# Altium project backscatter_radio.PrjPCB
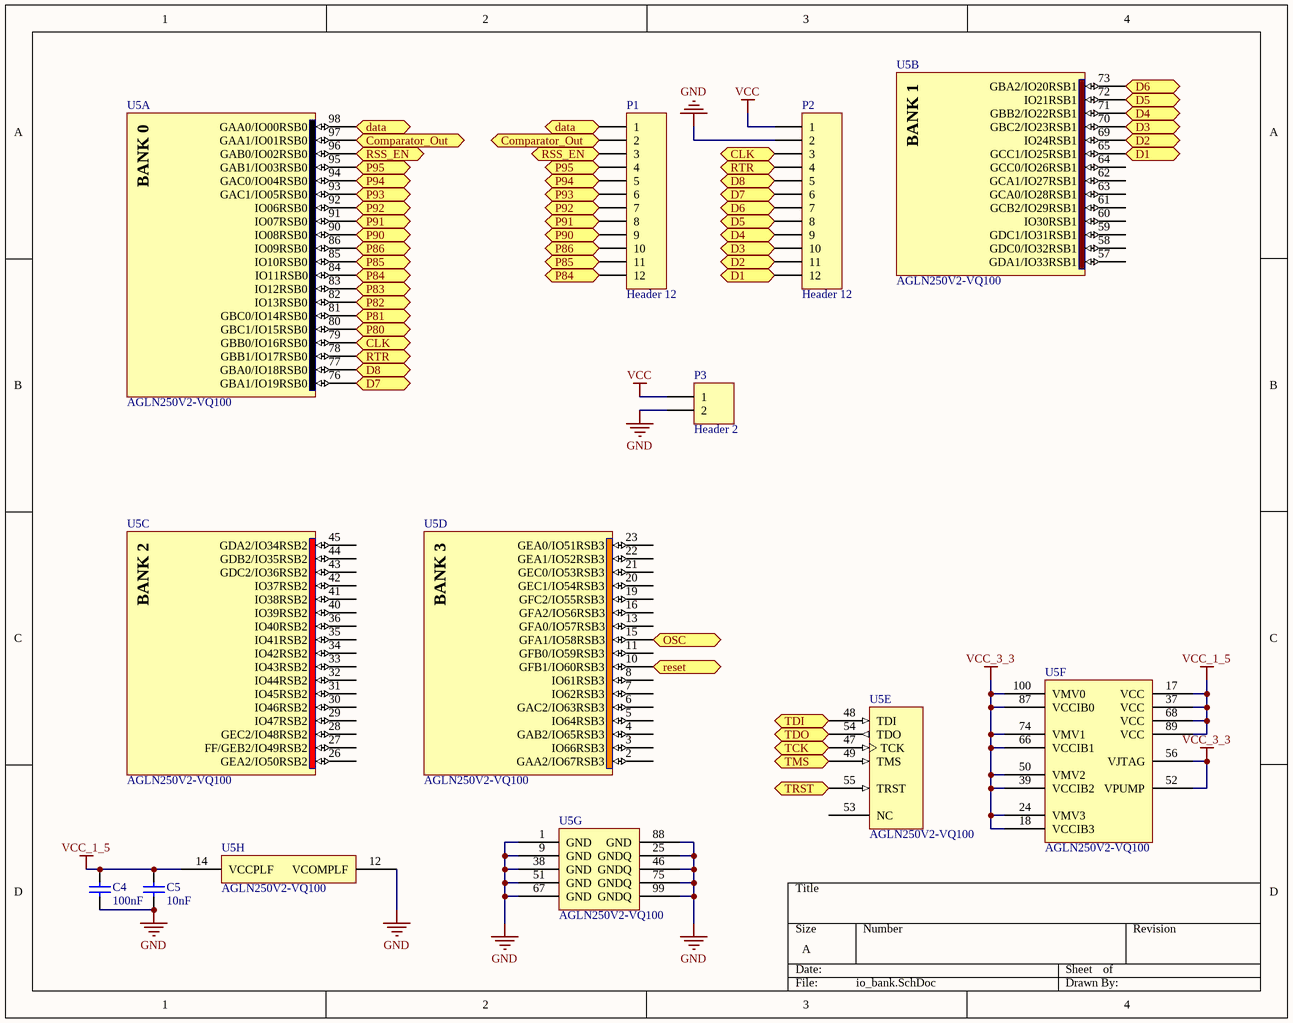
[diagram p0: io_bank.SchDoc]
3 sheets, 60 parts. Net scope: flat (ports and power ports of the same name join across sheets).
Board file: fpga_radio.PcbDoc
Sheets:
  io_bank.SchDoc
  power.SchDoc
  mimo.SchDoc

## Sheet io_bank.SchDoc
size A

### Parts
C4  value 100nF  [0603]  (hidden comment: Cap)
C5  value 10nF  [0603]  (hidden comment: Cap)
P1  Header 12  [HDR1X12]
P2  Header 12  [HDR1X12]
P3  Header 2  [HDR1X2]
U5  AGLN250V2-VQ100  [VQ100_N]  (parts A,B,C,D,E,F,G,H of 8)

### Ports
CLK, Comparator_Out, D1, D2, D3, D4, D5, D6, D7, D8, data, OSC, P80, P81, P82, P83, P84, P85, P86, P90, P91, P92, P93, P94, P95, reset, RSS_EN, RTR, TCK, TDI, TDO, TMS, TRST

### Nets
GND: C4.1 C5.1 P2.2 P3.2 U5.1(GND) U5.9(GND) U5.12(VCOMPLF) U5.25(GNDQ) U5.38(GND) U5.46(GNDQ) U5.51(GND) U5.67(GND) U5.75(GNDQ) U5.88(GND) U5.99(GNDQ)
VCC: P2.1 P3.1
VCC_1_5: C4.2 C5.2 U5.14(VCCPLF) U5.17(VCC) U5.37(VCC) U5.68(VCC) U5.89(VCC)
VCC_3_3: U5.18(VCCIB3) U5.24(VMV3) U5.39(VCCIB2) U5.50(VMV2) U5.52(VPUMP) U5.56(VJTAG) U5.66(VCCIB1) U5.74(VMV1) U5.87(VCCIB0) U5.100(VMV0)
NetC32_2: U5.10(GFB1/IO60RSB3) ; port reset
NetP1_1: P1.1 U5.98(GAA0/IO00RSB0) ; port data
NetP1_2: P1.2 U5.97(GAA1/IO01RSB0) ; port Comparator_Out
NetP1_3: P1.3 U5.96(GAB0/IO02RSB0) ; port RSS_EN
NetP1_4: P1.4 U5.95(GAB1/IO03RSB0) ; port P95
NetP1_5: P1.5 U5.94(GAC0/IO04RSB0) ; port P94
NetP1_6: P1.6 U5.93(GAC1/IO05RSB0) ; port P93
NetP1_7: P1.7 U5.92(IO06RSB0) ; port P92
NetP1_8: P1.8 U5.91(IO07RSB0) ; port P91
NetP1_9: P1.9 U5.90(IO08RSB0) ; port P90
NetP1_10: P1.10 U5.86(IO09RSB0) ; port P86
NetP1_11: P1.11 U5.85(IO10RSB0) ; port P85
NetP1_12: P1.12 U5.84(IO11RSB0) ; port P84
NetP2_3: P2.3 U5.79(GBB0/IO16RSB0) ; port CLK
NetP2_4: P2.4 U5.78(GBB1/IO17RSB0) ; port RTR
NetP2_5: P2.5 U5.77(GBA0/IO18RSB0) ; port D8
NetP2_6: P2.6 U5.76(GBA1/IO19RSB0) ; port D7
NetP2_7: P2.7 U5.73(GBA2/IO20RSB1) ; port D6
NetP2_8: P2.8 U5.72(IO21RSB1) ; port D5
NetP2_9: P2.9 U5.71(GBB2/IO22RSB1) ; port D4
NetP2_10: P2.10 U5.70(GBC2/IO23RSB1) ; port D3
NetP2_11: P2.11 U5.69(IO24RSB1) ; port D2
NetP2_12: P2.12 U5.65(GCC1/IO25RSB1) ; port D1
NetP4_1: U5.47(TCK) ; port TCK
NetP4_3: U5.54(TDO) ; port TDO
NetP4_5: U5.49(TMS) ; port TMS
NetP4_8: U5.55(TRST) ; port TRST
NetP4_9: U5.48(TDI) ; port TDI
NetU5_15: U5.15(GFA1/IO58RSB3) ; port OSC
NetU5_80: U5.80(GBC1/IO15RSB0) ; port P80
NetU5_81: U5.81(GBC0/IO14RSB0) ; port P81
NetU5_82: U5.82(IO13RSB0) ; port P82
NetU5_83: U5.83(IO12RSB0) ; port P83

Not connected (* = marked no-connect by the designer): U5 2(GAA2/IO67RSB3) 3(IO66RSB3) 4(GAB2/IO65RSB3) 5(IO64RSB3) 6(GAC2/IO63RSB3) 7(IO62RSB3) 8(IO61RSB3) 11(GFB0/IO59RSB3) 13(GFA0/IO57RSB3) 16(GFA2/IO56RSB3) 19(GFC2/IO55RSB3) 20(GEC1/IO54RSB3) 21(GEC0/IO53RSB3) 22(GEA1/IO52RSB3) 23(GEA0/IO51RSB3) 26(GEA2/IO50RSB2) 27(FF/GEB2/IO49RSB2) 28(GEC2/IO48RSB2) 29(IO47RSB2) 30(IO46RSB2) 31(IO45RSB2) 32(IO44RSB2) 33(IO43RSB2) 34(IO42RSB2) 35(IO41RSB2) 36(IO40RSB2) 40(IO39RSB2) 41(IO38RSB2) 42(IO37RSB2) 43(GDC2/IO36RSB2) 44(GDB2/IO35RSB2) 45(GDA2/IO34RSB2) 53(NC) 57(GDA1/IO33RSB1) 58(GDC0/IO32RSB1) 59(GDC1/IO31RSB1) 60(IO30RSB1) 61(GCB2/IO29RSB1) 62(GCA1/IO27RSB1) 63(GCA0/IO28RSB1) 64(GCC0/IO26RSB1)

### Notes on the sheet
- (in symbol AGLN250V2-VQ100, part A) BANK 0
- (in symbol AGLN250V2-VQ100, part B) BANK 1
- (in symbol AGLN250V2-VQ100, part C) BANK 2
- (in symbol AGLN250V2-VQ100, part D) BANK 3

### Library data of the parts
C4 C5 = Cap: Ceramic Capacitor (Surface Mount); Manufacturer: Generic Ceramic Chip Cap (TBD); Digi-Key Part Number: *; Manufacturer Part Number: *; Note: *; Rating: *
P1 P2 = Header 12: Header, 12-Pin; LatestRevisionDate: 17-Jul-2002; LatestRevisionNote: Re-released for DXP Platform.; Publisher: Altium Limited
P3 = Header 2: Header, 2-Pin; LatestRevisionDate: 17-Jul-2002; LatestRevisionNote: Re-released for DXP Platform.; Publisher: Altium Limited
U5 = AGLN250V2-VQ100: IGLOO nano Low-Power Flash 1.2 to 1.5V FPGA with Flash*Freeze, 68 User IOs, 250K System Gates, 1Kbit Flash ROM, 100-Pin TQFP, Commercial Grade; Published: 29-May-2009; LatestRevisionDate: 26-Feb-2010; LatestRevisionNote: Updated to datasheet version 0.8 Jan-2010.; DatasheetVersion: v0.8, Jan-2010; PackageVersion: ver11.2, Nov-2009; PackageReference: VQ100; Publisher: Altium Limited; PackageDescription: 100-Pin Plastic Quad Flat Pack (VQ100); Code_JEDEC: MS-026-AED; ComponentLink1Description: IGLOO nano Datasheet; ComponentLink1URL: http://www.actel.com/documents/IGLOO_nano_DS.pdf; ComponentLink2Description: Package Mechanical Drawings; ComponentLink2URL: http://www.actel.com/documents/PckgMechDrwngs.pdf; ComponentLink3Description: IGLOO nano Documents; ComponentLink3URL: http://www.actel.com/products/igloonano/docs.aspx; ComponentLink4Description: Actel.com Home; ComponentLink4URL: http://www.actel.com/

## Sheet power.SchDoc
size A
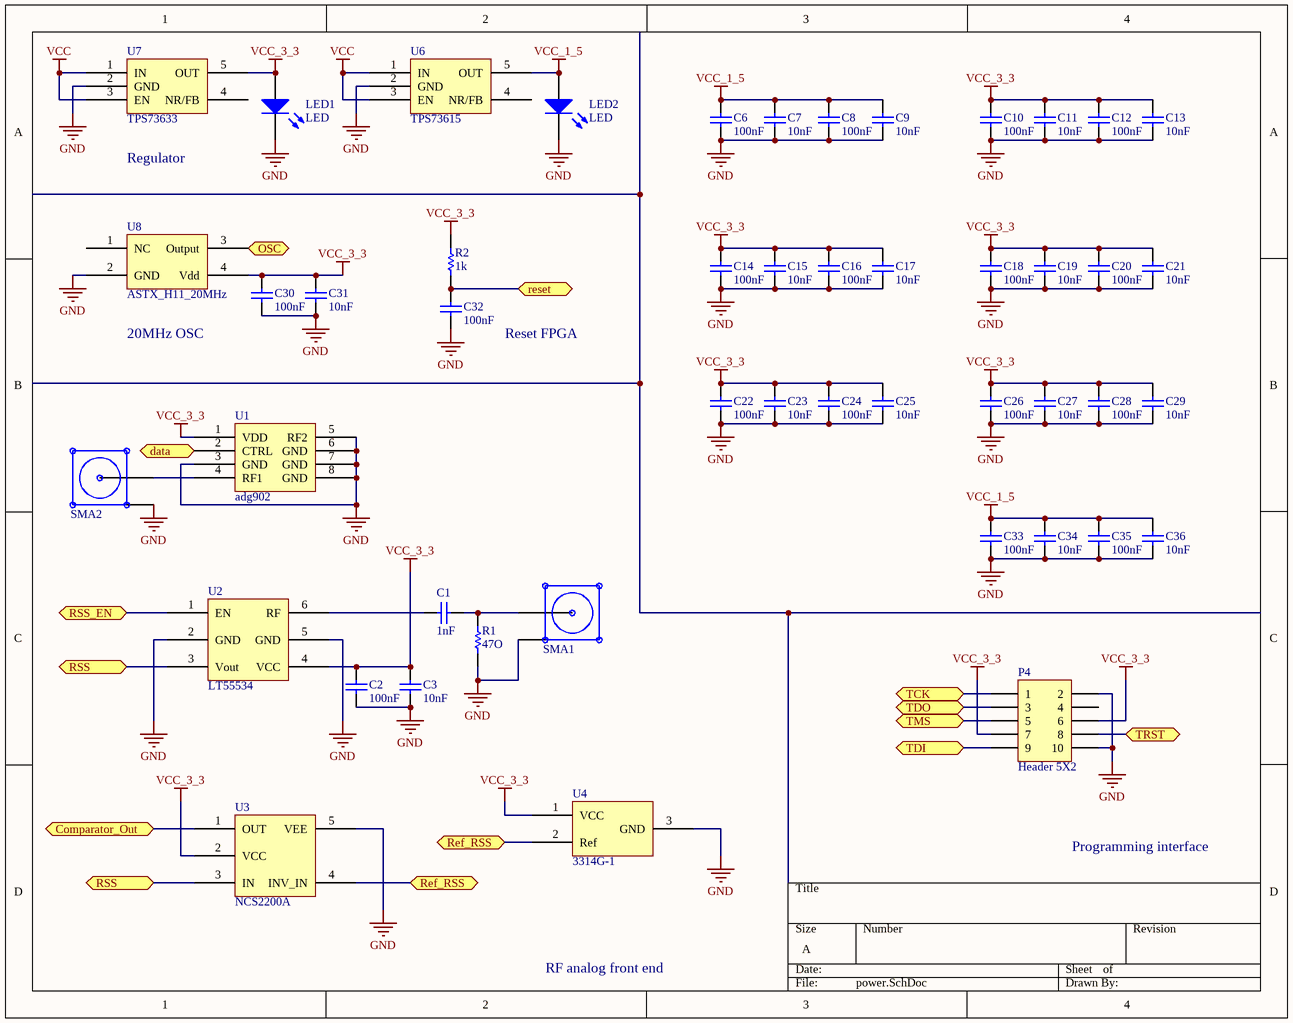
[diagram p1: power.SchDoc]

### Parts
C1  value 1nF  [0603]  (hidden comment: Cap)
C2  value 100nF  [0603]  (hidden comment: Cap)
C3  value 10nF  [0603]  (hidden comment: Cap)
C6  value 100nF  [0603]  (hidden comment: Cap)
C7  value 10nF  [0603]  (hidden comment: Cap)
C8  value 100nF  [0603]  (hidden comment: Cap)
C9  value 10nF  [0603]  (hidden comment: Cap)
C10  value 100nF  [0603]  (hidden comment: Cap)
C11  value 10nF  [0603]  (hidden comment: Cap)
C12  value 100nF  [0603]  (hidden comment: Cap)
C13  value 10nF  [0603]  (hidden comment: Cap)
C14  value 100nF  [0603]  (hidden comment: Cap)
C15  value 10nF  [0603]  (hidden comment: Cap)
C16  value 100nF  [0603]  (hidden comment: Cap)
C17  value 10nF  [0603]  (hidden comment: Cap)
C18  value 100nF  [0603]  (hidden comment: Cap)
C19  value 10nF  [0603]  (hidden comment: Cap)
C20  value 100nF  [0603]  (hidden comment: Cap)
C21  value 10nF  [0603]  (hidden comment: Cap)
C22  value 100nF  [0603]  (hidden comment: Cap)
C23  value 10nF  [0603]  (hidden comment: Cap)
C24  value 100nF  [0603]  (hidden comment: Cap)
C25  value 10nF  [0603]  (hidden comment: Cap)
C26  value 100nF  [0603]  (hidden comment: Cap)
C27  value 10nF  [0603]  (hidden comment: Cap)
C28  value 100nF  [0603]  (hidden comment: Cap)
C29  value 10nF  [0603]  (hidden comment: Cap)
C30  value 100nF  [0603]  (hidden comment: Cap)
C31  value 10nF  [0603]  (hidden comment: Cap)
C32  value 100nF  [0603]  (hidden comment: Cap)
C33  value 100nF  [0603]  (hidden comment: Cap)
C34  value 10nF  [0603]  (hidden comment: Cap)
C35  value 100nF  [0603]  (hidden comment: Cap)
C36  value 10nF  [0603]  (hidden comment: Cap)
LED1  LED  [0603]
LED2  LED  [0603]
P4  Header 5X2  [HDR2X5]
R1  value 47O  [0603]  (hidden comment: Res)
R2  value 1k  [0603]  (hidden comment: Res)
SMA1  SMA - Hole - 5 Pin  [SMA - Hole - 5 Pin]  (value not drawn)
SMA2  SMA - Hole - 5 Pin  [SMA - Hole - 5 Pin]  (value not drawn)
U1  adg902  [ADG902]
U2  LT55534  [LT5534]
U3  NCS2200A  [NCS2200]
U4  3314G-1  [3314G-1]
U6  TPS73615  [TPS73633]
U7  TPS73633  [TPS73633]
U8  ASTX_H11_20MHz  [ASTX_H11]

### Ports
Comparator_Out, data, OSC, Ref_RSS, reset, RSS, RSS_EN, TCK, TDI, TDO, TMS, TRST

### Nets
GND: C2.1 C3.1 C6.1 C7.1 C8.1 C9.1 C10.1 C11.1 C12.1 C13.1 C14.1 C15.1 C16.1 C17.1 C18.1 C19.1 C20.1 C21.1 C22.1 C23.1 C24.1 C25.1 C26.1 C27.1 C28.1 C29.1 C30.1 C31.1 C32.1 C33.1 C34.1 C35.1 C36.1 LED1.2(K) LED2.2(K) P4.2 P4.10 R1.1 SMA1.1 SMA2.1 U1.3(GND) U1.5(RF2) U1.6(GND) U1.7(GND) U1.8(GND) U2.2(GND) U2.5(GND) U3.5(VEE) U4.3(GND) U6.2(GND) U7.2(GND) U8.2(GND)
VCC: U6.1(IN) U6.3(EN) U7.1(IN) U7.3(EN)
VCC_1_5: C6.2 C7.2 C8.2 C9.2 C33.2 C34.2 C35.2 C36.2 LED2.1(A) U6.5(OUT)
VCC_3_3: C2.2 C3.2 C10.2 C11.2 C12.2 C13.2 C14.2 C15.2 C16.2 C17.2 C18.2 C19.2 C20.2 C21.2 C22.2 C23.2 C24.2 C25.2 C26.2 C27.2 C28.2 C29.2 C30.2 C31.2 LED1.1(A) P4.6 P4.7 R2.2 U1.1(VDD) U2.4(VCC) U3.2(VCC) U4.1(VCC) U7.5(OUT) U8.4(Vdd)
NetC1_1: C1.1 U2.6(RF)
NetC1_2: C1.2 R1.2 SMA1.2
NetC32_2: C32.2 R2.1 ; port reset
NetP1_1: U1.2(CTRL) ; port data
NetP1_2: U3.1(OUT) ; port Comparator_Out
NetP1_3: U2.1(EN) ; port RSS_EN
NetP4_1: P4.1 ; port TCK
NetP4_3: P4.3 ; port TDO
NetP4_5: P4.5 ; port TMS
NetP4_8: P4.8 ; port TRST
NetP4_9: P4.9 ; port TDI
NetSMA2_2: SMA2.2 U1.4(RF1)
NetU2_3: U2.3(Vout) U3.3(IN) ; port RSS
NetU3_4: U3.4(INV_IN) U4.2(Ref) ; port Ref_RSS
NetU5_15: U8.3(Output) ; port OSC

Not connected (* = marked no-connect by the designer): P4 4; U6 4(NR/FB); U7 4(NR/FB); U8 1(NC)

### Notes on the sheet
- Regulator
- 20MHz OSC
- Reset FPGA
- Programming interface
- RF analog front end

### Library data of the parts
C1-C3 C6-C36 = Cap: as C4 on sheet io_bank; Digi-Key Part Number: *; Manufacturer Part Number: *; Note: *; Rating: *
P4 = Header 5X2: Header, 5-Pin, Dual row; LatestRevisionDate: 17-Jul-2002; LatestRevisionNote: Re-released for DXP Platform.; Publisher: Altium Limited
R1 R2 = Res: Chip Resistor (Surface Mount); Manufacturer: Generic Chip Res (TBD); Manufacturer Part Number: *; Digi-Key Part Number: *; Rating: *
SMA1 SMA2 = SMA - Hole - 5 Pin: SMA - Through Hole Connector; Manufacturer Part Number: *; Manufacturer: *; Digi-Key Part Number: *; Note: *

## Sheet mimo.SchDoc
size A
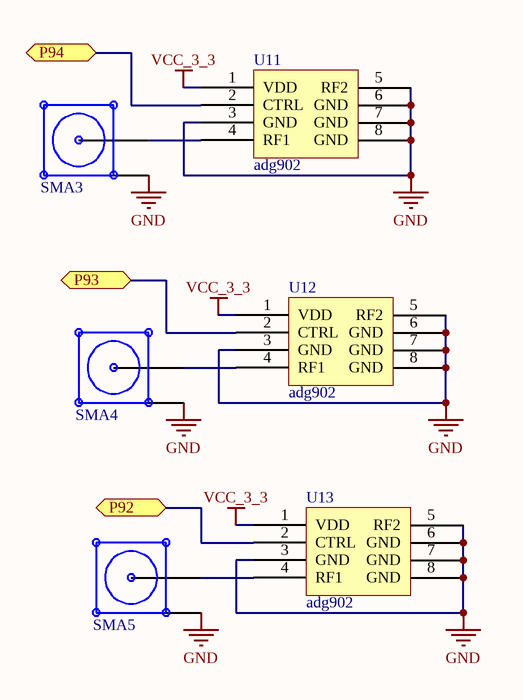
[diagram p2: mimo.SchDoc]

### Parts
SMA3  SMA - Hole - 5 Pin  [SMA - Hole - 5 Pin]  (value not drawn)
SMA4  SMA - Hole - 5 Pin  [SMA - Hole - 5 Pin]  (value not drawn)
SMA5  SMA - Hole - 5 Pin  [SMA - Hole - 5 Pin]  (value not drawn)
U11  adg902  [ADG902]
U12  adg902  [ADG902]
U13  adg902  [ADG902]

### Ports
P92, P93, P94

### Nets
GND: SMA3.1 SMA4.1 SMA5.1 U11.3(GND) U11.5(RF2) U11.6(GND) U11.7(GND) U11.8(GND) U12.3(GND) U12.5(RF2) U12.6(GND) U12.7(GND) U12.8(GND) U13.3(GND) U13.5(RF2) U13.6(GND) U13.7(GND) U13.8(GND)
VCC_3_3: U11.1(VDD) U12.1(VDD) U13.1(VDD)
NetP1_5: U11.2(CTRL) ; port P94
NetP1_6: U12.2(CTRL) ; port P93
NetP1_7: U13.2(CTRL) ; port P92
NetSMA3_2: SMA3.2 U11.4(RF1)
NetSMA4_2: SMA4.2 U12.4(RF1)
NetSMA5_2: SMA5.2 U13.4(RF1)

### Library data of the parts
SMA3-SMA5 = SMA - Hole - 5 Pin: SMA - Through Hole Connector; Manufacturer Part Number: *; Manufacturer: *; Digi-Key Part Number: *; Note: *

## Nets that join several sheets
GND: io_bank (15 pins), power (52 pins), mimo (18 pins)
VCC: io_bank (P2.1 P3.1), power (U6.1 U6.3 U7.1 U7.3)
VCC_1_5: io_bank (7 pins), power (10 pins)
VCC_3_3: io_bank (10 pins), power (34 pins), mimo (U11.1 U12.1 U13.1)
NetC32_2: io_bank (U5.10), power (C32.2 R2.1)
NetP1_1: io_bank (P1.1 U5.98), power (U1.2)
NetP1_2: io_bank (P1.2 U5.97), power (U3.1)
NetP1_3: io_bank (P1.3 U5.96), power (U2.1)
NetP1_5: io_bank (P1.5 U5.94), mimo (U11.2)
NetP1_6: io_bank (P1.6 U5.93), mimo (U12.2)
NetP1_7: io_bank (P1.7 U5.92), mimo (U13.2)
NetP4_1: io_bank (U5.47), power (P4.1)
NetP4_3: io_bank (U5.54), power (P4.3)
NetP4_5: io_bank (U5.49), power (P4.5)
NetP4_8: io_bank (U5.55), power (P4.8)
NetP4_9: io_bank (U5.48), power (P4.9)
NetU5_15: io_bank (U5.15), power (U8.3)